# Altium schematic sheet Slave_Schematic.SchDoc
size A4; SheetNumber: 1; SheetTotal: 2
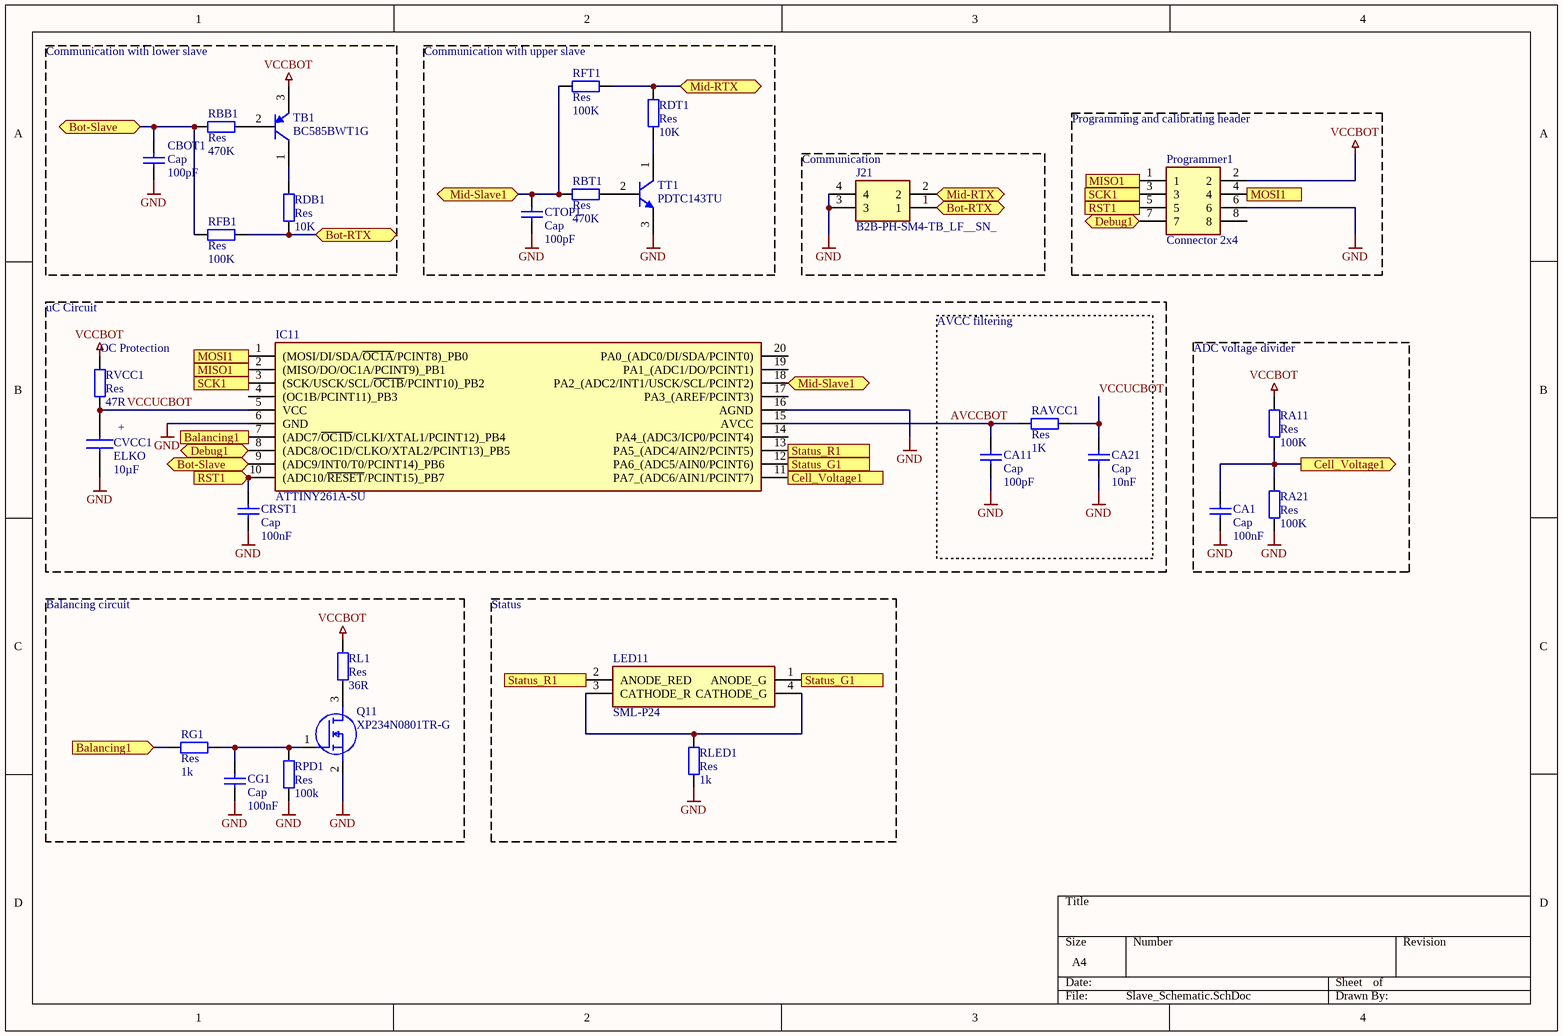
[diagram p0: Slave_Schematic.SchDoc]

## Parts
CA1  Cap  value 100nF  [0603]
CA11  Cap  value 100pF  [0603]
CA21  Cap  value 10nF  [0603]
CBOT1  Cap  value 100pF  [0603]
CG1  Cap  value 100nF  [0603]
CRST1  Cap  value 100nF  [0603]
CTOP1  Cap  value 100pF  [0603]
CVCC1  ELKO  value 10µF  [CAP 5x5,5]
IC11  ATTINY261A-SU  [TSSOP-20T (MO-153 AC)]
J21  B2B-PH-SM4-TB_LF__SN_  [JST-PHR]
LED11  SML-P24  [1010 LED]
Programmer1  Connector 2x4  [Pads 2X4]
Q11  XP234N0801TR-G  [SOT-23 (TO-236)]
RA11  Res  value 100K  [0603]
RA21  Res  value 100K  [0603]
RAVCC1  Res  value 1K  [0603]
RBB1  Res  value 470K  [0603]
RBT1  Res  value 470K  [0603]
RDB1  Res  value 10K  [0603]
RDT1  Res  value 10K  [0603]
RFB1  Res  value 100K  [0603]
RFT1  Res  value 100K  [0603]
RG1  Res  value 1k  [0603]
RL1  Res  value 36R  [1020 (Reversed)]
RLED1  Res  value 1k  [0603]
RPD1  Res  value 100k  [0603]
RVCC1  Res  value 47R  [0603]
TB1  BC585BWT1G  [SOT-323 (SC-70)]
TT1  PDTC143TU  [SOT-323 (SC-70)]

## Blocks framed on the sheet
Communication with lower slave: CBOT1 RBB1 RDB1 RFB1 TB1
Communication with upper slave: CTOP1 RBT1 RDT1 RFT1 TT1
Programming and calibrating header: Programmer1
Communication: J21
AVCC filtering: CA11 CA21 RAVCC1
ADC voltage divider: CA1 RA11 RA21
Balancing circuit: CG1 Q11 RG1 RL1 RPD1
Status: LED11 RLED1

## Ports
Balancing1 (in), Balancing1 (out), Bot-RTX (bidir), Bot-Slave (bidir), Cell_Voltage1 (in), Cell_Voltage1 (out), Debug1 (bidir), Mid-RTX (bidir), Mid-Slave1 (bidir), MISO1 (in), MISO1 (out), MOSI1 (in), MOSI1 (out), RST1 (in), RST1 (out), SCK1 (in), SCK1 (out), Status_G1 (in), Status_G1 (out), Status_R1 (in), Status_R1 (out)

## Nets
GND: CA1.1 CA11.1 CA21.1 CBOT1.1 CG1.1 CRST1.1 CTOP1.1 CVCC1.2(-) IC11.6(GND) IC11.16(AGND) J21.3 J21.4 Programmer1.6 Q11.2(S) RA21.1 RLED1.1 RPD1.1 TT1.3(E)
VCCBOT: Programmer1.2 RA11.2 RL1.2 RVCC1.2 TB1.3(E)
AVCCBOT: CA11.2 IC11.15(AVCC) RAVCC1.1
Balancing1: IC11.7((ADC7/~{OC1D}/CLKI/XTAL1/PCINT12)_PB4) RG1.1 ; port Balancing1
Bot-RTX: J21.1 RDB1.1 RFB1.2 ; port Bot-RTX
Bot-Slave: CBOT1.2 IC11.9((ADC9/INT0/T0/PCINT14)_PB6) RBB1.1 RFB1.1 ; port Bot-Slave
Cell_Voltage1: CA1.2 IC11.11(PA7_(ADC6/AIN1/PCINT7)) RA11.1 RA21.2 ; port Cell_Voltage1
Debug1: IC11.8((ADC8/OC1D/CLKO/XTAL2/PCINT13)_PB5) Programmer1.7 ; port Debug1
Mid-RTX: J21.2 RDT1.2 RFT1.2 ; port Mid-RTX
Mid-Slave1: CTOP1.2 IC11.18(PA2_(ADC2/INT1/USCK/SCL/PCINT2)) RBT1.1 RFT1.1 ; port Mid-Slave1
MISO1: IC11.2((MISO/DO/OC1A/PCINT9)_PB1) Programmer1.1 ; port MISO1
MOSI1: IC11.1((MOSI/DI/SDA/~{OC1A}/PCINT8)_PB0) Programmer1.4 ; port MOSI1
RST1: CRST1.2 IC11.10((ADC10/~{RESET}/PCINT15)_PB7) Programmer1.5 ; port RST1
SCK1: IC11.3((SCK/USCK/SCL/~{OC1B}/PCINT10)_PB2) Programmer1.3 ; port SCK1
Status_G1: IC11.12(PA6_(ADC5/AIN0/PCINT6)) LED11.1(ANODE_G) ; port Status_G1
Status_R1: IC11.13(PA5_(ADC4/AIN2/PCINT5)) LED11.2(ANODE_RED) ; port Status_R1
VCCUCBOT: CA21.2 CVCC1.1(+) IC11.5(VCC) RAVCC1.2 RVCC1.1
NetCG1_2: CG1.2 Q11.1(G) RG1.2 RPD1.2
NetLED11_3: LED11.3(CATHODE_R) LED11.4(CATHODE_G) RLED1.2
NetQ11_3: Q11.3(D) RL1.1
NetRBB1_2: RBB1.2 TB1.2(B)
NetRBT1_2: RBT1.2 TT1.2(B)
NetRDB1_2: RDB1.2 TB1.1(C)
NetRDT1_1: RDT1.1 TT1.1(C)

Not connected (* = marked no-connect by the designer): IC11 4((OC1B/PCINT11)_PB3) 14(PA4_(ADC3/ICP0/PCINT4)) 17(PA3_(AREF/PCINT3)) 19(PA1_(ADC1/DO/PCINT1)) 20(PA0_(ADC0/DI/SDA/PCINT0)); Programmer1 8

## Notes on the sheet
- uC Circuit
- (near RVCC1) OC Protection

## Library data of the parts
CA1 CA11 CA21 CBOT1 CG1 CRST1 CTOP1 = Cap: Capacitor; Published: 8-Jun-2000; LatestRevisionDate: 17-Jul-2002; LatestRevisionNote: Re-released for DXP Platform.; PackageReference: RAD-0.3; Publisher: Altium Limited; PackageDescription: Radial Cap, Thru-Hole; 2 Leads; 0.3 in Pin Spacing
CVCC1 = ELKO: Capacitor; Manufacturer_Name: NIC Components; Manufacturer_Part_Number: NACE470M6.3V5X5.5TR13F; Datasheet Link: https://docs.rs-online.com/e28d/0900766b80f8cf40.pdf; Height: 5.5mm
IC11 = ATTINY261A-SU: Integrated Circuit; Manufacturer_Name: Microchip; Datasheet Link: http://www.atmel.com/Images/doc8197.pdf; Height: 2.65mm; Manufacturer_Part_Number: ATTINY261A-SU; Mouser Part Number: 556-ATTINY261A-SU; Mouser Price/Stock: https://www.mouser.co.uk/ProductDetail/Microchip-Technology-Atmel/ATTINY261A-SU?qs=LHmEVA8xxfYkt4Dy%2F2AOtw%3D%3D; Arrow Part Number: ATTINY261A-SU; Arrow Price/Stock: https://www.arrow.com/en/products/attiny261a-su/microchip-technology
J21 = B2B-PH-SM4-TB_LF__SN_: Connector; Manufacturer_Name: JST (JAPAN SOLDERLESS TERMINALS); Manufacturer_Part_Number: B2B-PH-SM4-TB(LF)(SN); Datasheet Link: http://www.jst-mfg.com/product/pdf/eng/ePH.pdf; Height: 6.6mm
LED11 = SML-P24: Dual Color LED; Manufacturer_Name: ROHM Semiconductor; Manufacturer_Part_Number: SML-P24MUWT86R; Datasheet Link: https://www.rohm.com/datasheet/SML-P24MUW(R)/sml-p24muw-e; Height: 0.25mm; Mouser Part Number: 755-SML-P24MUWT86R; Mouser Price/Stock: https://www.mouser.co.uk/ProductDetail/ROHM-Semiconductor/SML-P24MUWT86R?qs=SP2aZMzhwxgr8eZ6SbTI9w%3D%3D
Programmer1 = Connector 2x4: Connector 1,27mm; Manufacturer_Name: Mill-Max; Manufacturer_Part_Number: 855-22-008-10-001101; Datasheet Link: https://componentsearchengine.com/Datasheets/2/855-22-008-10-001101.pdf; Height: 6.27mm; Mouser Part Number: 575-855-22-008-10; Mouser Price/Stock: https://www.mouser.co.uk/ProductDetail/Mill-Max/855-22-008-10-001101?qs=mPCt1EmoOdQMosTdRU7w4Q%3D%3D
Q11 = XP234N0801TR-G: MOSFET (N-Channel); Manufacturer_Name: Torex; Datasheet Link: https://4donline.ihs.com/images/VipMasterIC/IC/TOSL/TOSL-S-A0008892481/TOSL-S-A0008892481-1.pdf?hkey=CECEF36DEECDED6468708AAF2E19C0C6; Height: 1.15mm; Manufacturer_Part_Number: XP234N0801TR-G; Mouser Part Number: 865-XP234N0801TR-G; Mouser Price/Stock: https://www.mouser.co.uk/ProductDetail/Torex-Semiconductor/XP234N0801TR-G?qs=BJlw7L4Cy7%252BWe%2FbHvnXcKQ%3D%3D
RA11 RA21 RAVCC1 RBB1 RBT1 RDB1 RDT1 RFB1 RFT1 RG1 RL1 RLED1 RPD1 RVCC1 = Res: Resistor; Published: 8-Jun-2000; LatestRevisionDate: 17-Jul-2002; LatestRevisionNote: Re-released for DXP Platform.; PackageReference: AXIAL-0.4; Publisher: Altium Limited; PackageDescription: Axial Device, Thru-Hole; 2 Leads; 0.4 in Pin Spacing
TB1 = BC585BWT1G: PNP; pin to pad: 1>3 2>1 3>2; Published: 8-Jun-2000; LatestRevisionDate: 29-May-2009; LatestRevisionNote: IPC-7351 Footprint Added.; PackageVersion: Aug-1999; PackageReference: SOT-23B; Publisher: Altium Limited; PackageDescription: 3-Pin SOT-23 Package 0.95 mm Pitch, 2.4 mm Lead Span
TT1 = PDTC143TU: NPN; pin to pad: 1>3 2>1 3>2; Published: 8-Jun-2000; LatestRevisionDate: 17-Jul-2002; LatestRevisionNote: Re-released for DXP Platform.; PackageReference: TO-226-AA; Publisher: Altium Limited; PackageDescription: TO, Flat Index; 3 In-Line, Axial Leads; Body Dia. 4.8mm; Leads 0.55 x 0.51 mm (max); Code_JEDEC: TO-226-AA